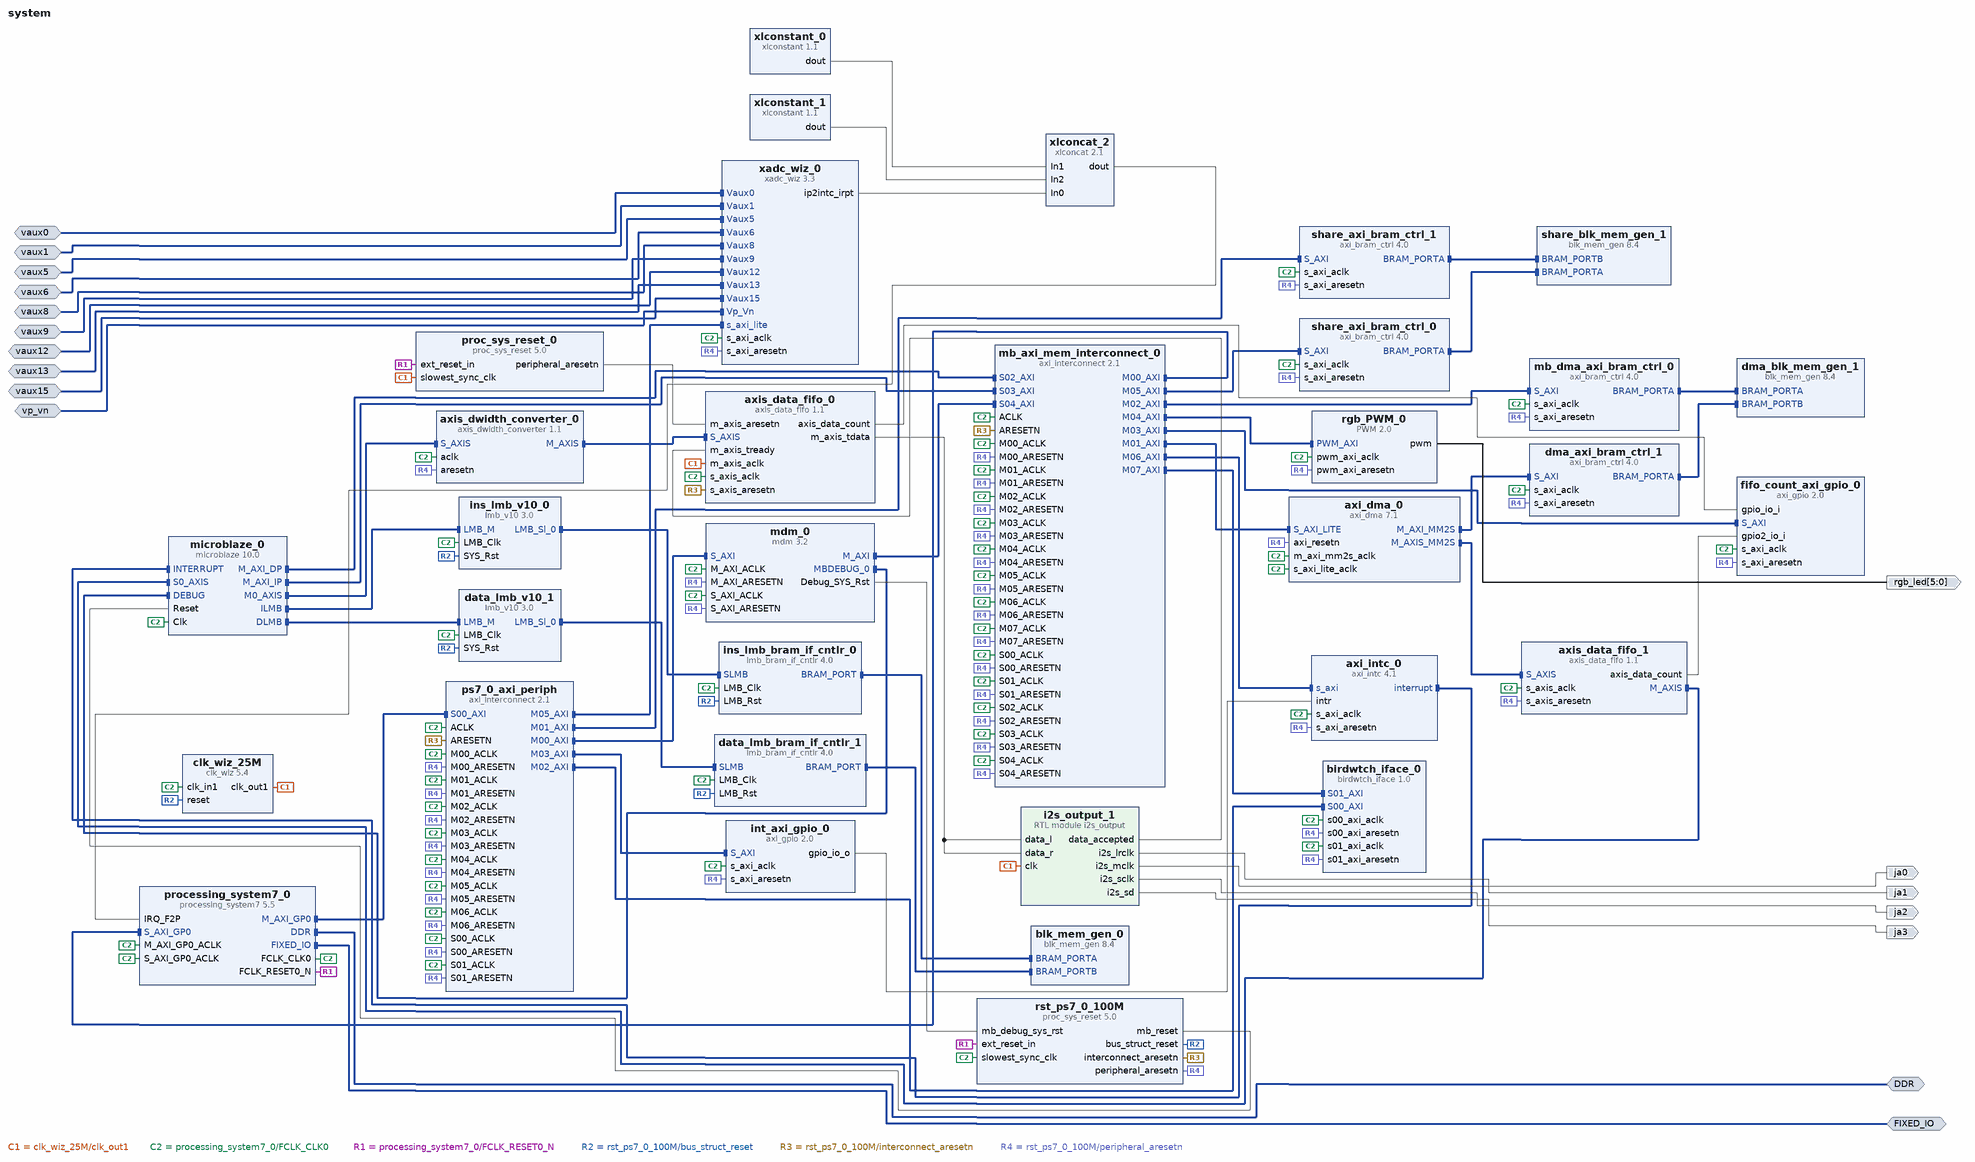
[diagram p0: block diagram of the top level]
# Vivado block design system, xc7z007sclg400-1, Vivado 2017.4
create_bd_design system

create_bd_intf_port -mode Master -vlnv xilinx.com:interface:ddrx_rtl:1.0 DDR
create_bd_intf_port -mode Master -vlnv xilinx.com:display_processing_system7:fixedio_rtl:1.0 FIXED_IO
create_bd_intf_port -mode Slave -vlnv xilinx.com:interface:diff_analog_io_rtl:1.0 vaux0
create_bd_intf_port -mode Slave -vlnv xilinx.com:interface:diff_analog_io_rtl:1.0 vaux1
create_bd_intf_port -mode Slave -vlnv xilinx.com:interface:diff_analog_io_rtl:1.0 vaux5
create_bd_intf_port -mode Slave -vlnv xilinx.com:interface:diff_analog_io_rtl:1.0 vaux6
create_bd_intf_port -mode Slave -vlnv xilinx.com:interface:diff_analog_io_rtl:1.0 vaux8
create_bd_intf_port -mode Slave -vlnv xilinx.com:interface:diff_analog_io_rtl:1.0 vaux9
create_bd_intf_port -mode Slave -vlnv xilinx.com:interface:diff_analog_io_rtl:1.0 vaux12
create_bd_intf_port -mode Slave -vlnv xilinx.com:interface:diff_analog_io_rtl:1.0 vaux13
create_bd_intf_port -mode Slave -vlnv xilinx.com:interface:diff_analog_io_rtl:1.0 vaux15
create_bd_intf_port -mode Slave -vlnv xilinx.com:interface:diff_analog_io_rtl:1.0 vp_vn
create_bd_port -dir O ja0
create_bd_port -dir O ja1
create_bd_port -dir O ja2
create_bd_port -dir O ja3
create_bd_port -dir O -from 5 -to 0 rgb_led

create_bd_cell -type ip -vlnv xilinx.com:ip:axi_dma:7.1 axi_dma_0
set_property -dict [list \
  CONFIG.c_include_sg 0 \
  CONFIG.c_include_mm2s 1 \
  CONFIG.c_m_axi_mm2s_data_width 32 \
  CONFIG.c_m_axis_mm2s_tdata_width 32 \
  CONFIG.c_mm2s_burst_size 16 \
  CONFIG.c_include_s2mm 0 \
] [get_bd_cells axi_dma_0]
create_bd_cell -type ip -vlnv xilinx.com:ip:axi_intc:4.1 axi_intc_0
set_property -dict {CONFIG.C_IRQ_IS_LEVEL 0} [get_bd_cells axi_intc_0]
create_bd_cell -type ip -vlnv xilinx.com:ip:axis_data_fifo:1.1 axis_data_fifo_0
set_property -dict [list \
  CONFIG.TDATA_NUM_BYTES 2 \
  CONFIG.FIFO_DEPTH 2048 \
  CONFIG.IS_ACLK_ASYNC 1 \
  CONFIG.ACLKEN_CONV_MODE 0 \
] [get_bd_cells axis_data_fifo_0]
create_bd_cell -type ip -vlnv xilinx.com:ip:axis_data_fifo:1.1 axis_data_fifo_1
set_property -dict {CONFIG.FIFO_DEPTH 2048} [get_bd_cells axis_data_fifo_1]
create_bd_cell -type ip -vlnv xilinx.com:ip:axis_dwidth_converter:1.1 axis_dwidth_converter_0
create_bd_cell -type ip -vlnv user.org:user:birdwtch_iface:1.0 birdwtch_iface_0
create_bd_cell -type ip -vlnv xilinx.com:ip:blk_mem_gen:8.4 blk_mem_gen_0
set_property -dict [list \
  CONFIG.Memory_Type True_Dual_Port_RAM \
  CONFIG.Enable_B Use_ENB_Pin \
  CONFIG.Use_RSTB_Pin true \
  CONFIG.Port_B_Clock 100 \
  CONFIG.Port_B_Write_Rate 50 \
  CONFIG.Port_B_Enable_Rate 100 \
] [get_bd_cells blk_mem_gen_0]
create_bd_cell -type ip -vlnv xilinx.com:ip:clk_wiz:5.4 clk_wiz_25M
set_property -dict [list \
  CONFIG.CLKOUT2_USED false \
  CONFIG.CLKOUT3_USED false \
  CONFIG.NUM_OUT_CLKS 1 \
  CONFIG.CLKOUT1_REQUESTED_OUT_FREQ 24.576 \
  CONFIG.CLKOUT2_REQUESTED_OUT_FREQ 100.000 \
  CONFIG.CLKOUT3_REQUESTED_OUT_FREQ 100.000 \
  CONFIG.CLKOUT3_REQUESTED_PHASE 0.000 \
  CONFIG.MMCM_DIVCLK_DIVIDE 5 \
  CONFIG.MMCM_CLKFBOUT_MULT_F 34.250 \
  CONFIG.MMCM_CLKOUT0_DIVIDE_F 27.875 \
  CONFIG.MMCM_CLKOUT1_DIVIDE 1 \
  CONFIG.MMCM_CLKOUT2_DIVIDE 1 \
  CONFIG.MMCM_CLKOUT2_PHASE 0.000 \
  CONFIG.CLKOUT1_JITTER 448.322 \
  CONFIG.CLKOUT1_PHASE_ERROR 335.207 \
  CONFIG.CLKOUT2_JITTER 783.134 \
  CONFIG.CLKOUT2_PHASE_ERROR 565.323 \
  CONFIG.CLKOUT3_JITTER 783.134 \
  CONFIG.CLKOUT3_PHASE_ERROR 565.323 \
] [get_bd_cells clk_wiz_25M]
create_bd_cell -type ip -vlnv xilinx.com:ip:lmb_bram_if_cntlr:4.0 data_lmb_bram_if_cntlr_1
create_bd_cell -type ip -vlnv xilinx.com:ip:lmb_v10:3.0 data_lmb_v10_1
create_bd_cell -type ip -vlnv xilinx.com:ip:axi_bram_ctrl:4.0 dma_axi_bram_ctrl_1
set_property -dict {CONFIG.DATA_WIDTH 32 CONFIG.SINGLE_PORT_BRAM 1} [get_bd_cells dma_axi_bram_ctrl_1]
create_bd_cell -type ip -vlnv xilinx.com:ip:blk_mem_gen:8.4 dma_blk_mem_gen_1
set_property -dict [list \
  CONFIG.Memory_Type True_Dual_Port_RAM \
  CONFIG.Enable_B Use_ENB_Pin \
  CONFIG.Use_RSTB_Pin true \
  CONFIG.Port_B_Clock 100 \
  CONFIG.Port_B_Write_Rate 50 \
  CONFIG.Port_B_Enable_Rate 100 \
] [get_bd_cells dma_blk_mem_gen_1]
create_bd_cell -type ip -vlnv xilinx.com:ip:axi_gpio:2.0 fifo_count_axi_gpio_0
set_property -dict [list \
  CONFIG.C_GPIO_WIDTH 32 \
  CONFIG.C_GPIO2_WIDTH 32 \
  CONFIG.C_IS_DUAL 1 \
  CONFIG.C_ALL_INPUTS 1 \
  CONFIG.C_ALL_INPUTS_2 1 \
] [get_bd_cells fifo_count_axi_gpio_0]
create_bd_cell -type module -reference i2s_output i2s_output_1
create_bd_cell -type ip -vlnv xilinx.com:ip:lmb_bram_if_cntlr:4.0 ins_lmb_bram_if_cntlr_0
create_bd_cell -type ip -vlnv xilinx.com:ip:lmb_v10:3.0 ins_lmb_v10_0
create_bd_cell -type ip -vlnv xilinx.com:ip:axi_gpio:2.0 int_axi_gpio_0
set_property -dict {CONFIG.C_GPIO_WIDTH 1 CONFIG.C_INTERRUPT_PRESENT 0 CONFIG.C_ALL_OUTPUTS 1} [get_bd_cells int_axi_gpio_0]
create_bd_cell -type ip -vlnv xilinx.com:ip:axi_interconnect:2.1 mb_axi_mem_interconnect_0
set_property -dict {CONFIG.NUM_SI 5 CONFIG.NUM_MI 8} [get_bd_cells mb_axi_mem_interconnect_0]
create_bd_cell -type ip -vlnv xilinx.com:ip:axi_bram_ctrl:4.0 mb_dma_axi_bram_ctrl_0
set_property -dict {CONFIG.SINGLE_PORT_BRAM 1} [get_bd_cells mb_dma_axi_bram_ctrl_0]
create_bd_cell -type ip -vlnv xilinx.com:ip:mdm:3.2 mdm_0
set_property -dict [list \
  CONFIG.C_S_AXI_ADDR_WIDTH 5 \
  CONFIG.C_USE_UART 1 \
  CONFIG.C_DBG_REG_ACCESS 1 \
  CONFIG.C_DBG_MEM_ACCESS 1 \
  CONFIG.C_USE_CROSS_TRIGGER 0 \
] [get_bd_cells mdm_0]
create_bd_cell -type ip -vlnv xilinx.com:ip:microblaze:10.0 microblaze_0
set_property -dict [list \
  CONFIG.C_ADDR_SIZE 32 \
  CONFIG.C_BASE_VECTORS 0x00000000 \
  CONFIG.C_D_AXI 1 \
  CONFIG.C_I_AXI 1 \
  CONFIG.C_USE_MSR_INSTR 0 \
  CONFIG.C_USE_PCMP_INSTR 0 \
  CONFIG.C_USE_BARREL 1 \
  CONFIG.C_USE_DIV 1 \
  CONFIG.C_USE_HW_MUL 1 \
  CONFIG.C_USE_FPU 0 \
  CONFIG.C_DEBUG_ENABLED 2 \
  CONFIG.C_NUMBER_OF_PC_BRK 2 \
  CONFIG.C_NUMBER_OF_RD_ADDR_BRK 0 \
  CONFIG.C_NUMBER_OF_WR_ADDR_BRK 0 \
  CONFIG.C_DEBUG_EVENT_COUNTERS 0 \
  CONFIG.C_DEBUG_LATENCY_COUNTERS 0 \
  CONFIG.C_FSL_LINKS 1 \
  CONFIG.C_ADDR_TAG_BITS 0 \
  CONFIG.C_DCACHE_ADDR_TAG 0 \
] [get_bd_cells microblaze_0]
create_bd_cell -type ip -vlnv xilinx.com:ip:proc_sys_reset:5.0 proc_sys_reset_0
create_bd_cell -type ip -vlnv xilinx.com:ip:processing_system7:5.5 processing_system7_0
set_property -dict [list \
  CONFIG.PCW_UIPARAM_DDR_FREQ_MHZ 525 \
  CONFIG.PCW_CRYSTAL_PERIPHERAL_FREQMHZ 50 \
  CONFIG.PCW_APU_PERIPHERAL_FREQMHZ 650 \
  CONFIG.PCW_SDIO_PERIPHERAL_FREQMHZ 50 \
  CONFIG.PCW_UART_PERIPHERAL_FREQMHZ 100 \
  CONFIG.PCW_I2C_PERIPHERAL_FREQMHZ 108.333336 \
  CONFIG.PCW_FPGA0_PERIPHERAL_FREQMHZ 100 \
  CONFIG.PCW_FPGA1_PERIPHERAL_FREQMHZ 200 \
  CONFIG.PCW_FPGA2_PERIPHERAL_FREQMHZ 120 \
  CONFIG.PCW_USE_S_AXI_GP0 1 \
  CONFIG.PCW_USE_FABRIC_INTERRUPT 1 \
  CONFIG.PCW_UART0_BAUD_RATE 921600 \
  CONFIG.PCW_IRQ_F2P_INTR 1 \
  CONFIG.PCW_GP0_EN_MODIFIABLE_TXN 0 \
  CONFIG.PCW_GP1_EN_MODIFIABLE_TXN 0 \
  CONFIG.PCW_PERIPHERAL_BOARD_PRESET part0 \
  CONFIG.PCW_PRESET_BANK1_VOLTAGE {LVCMOS 1.8V} \
  CONFIG.PCW_UIPARAM_DDR_BUS_WIDTH {16 Bit} \
  CONFIG.PCW_UIPARAM_DDR_PARTNO {MT41K256M16 RE-125} \
  CONFIG.PCW_QSPI_PERIPHERAL_ENABLE 0 \
  CONFIG.PCW_ENET0_PERIPHERAL_ENABLE 1 \
  CONFIG.PCW_ENET0_ENET0_IO {MIO 16 .. 27} \
  CONFIG.PCW_ENET0_GRP_MDIO_ENABLE 1 \
  CONFIG.PCW_ENET0_GRP_MDIO_IO {MIO 52 .. 53} \
  CONFIG.PCW_ENET_RESET_ENABLE 1 \
  CONFIG.PCW_ENET_RESET_SELECT {Share reset pin} \
  CONFIG.PCW_ENET0_RESET_ENABLE 1 \
  CONFIG.PCW_ENET0_RESET_IO {MIO 9} \
  CONFIG.PCW_SD0_PERIPHERAL_ENABLE 1 \
  CONFIG.PCW_SD0_SD0_IO {MIO 40 .. 45} \
  CONFIG.PCW_SD0_GRP_CD_ENABLE 1 \
  CONFIG.PCW_SD0_GRP_CD_IO {MIO 47} \
  CONFIG.PCW_SD0_GRP_WP_ENABLE 0 \
  CONFIG.PCW_UART0_PERIPHERAL_ENABLE 1 \
  CONFIG.PCW_UART0_UART0_IO {MIO 14 .. 15} \
  CONFIG.PCW_UART1_PERIPHERAL_ENABLE 0 \
  CONFIG.PCW_SPI0_PERIPHERAL_ENABLE 1 \
  CONFIG.PCW_SPI0_SPI0_IO EMIO \
  CONFIG.PCW_USB0_PERIPHERAL_ENABLE 1 \
  CONFIG.PCW_USB0_USB0_IO {MIO 28 .. 39} \
  CONFIG.PCW_USB_RESET_ENABLE 1 \
  CONFIG.PCW_USB_RESET_SELECT {Share reset pin} \
  CONFIG.PCW_USB0_RESET_ENABLE 1 \
  CONFIG.PCW_USB0_RESET_IO {MIO 46} \
  CONFIG.PCW_I2C0_PERIPHERAL_ENABLE 1 \
  CONFIG.PCW_I2C0_I2C0_IO EMIO \
  CONFIG.PCW_I2C_RESET_ENABLE 1 \
  CONFIG.PCW_I2C_RESET_SELECT {Share reset pin} \
  CONFIG.PCW_GPIO_MIO_GPIO_ENABLE 1 \
  CONFIG.PCW_GPIO_MIO_GPIO_IO MIO \
] [get_bd_cells processing_system7_0]
# 507 more settings of processing_system7_0 are not shown: defaults, MIO pin electricals, DDR timing, and values the tool derives
create_bd_cell -type ip -vlnv xilinx.com:ip:axi_interconnect:2.1 ps7_0_axi_periph
set_property -dict {CONFIG.NUM_SI 2 CONFIG.NUM_MI 7} [get_bd_cells ps7_0_axi_periph]
create_bd_cell -type ip -vlnv digilentinc.com:IP:PWM:2.0 rgb_PWM_0
set_property -dict {CONFIG.NUM_PWM 6} [get_bd_cells rgb_PWM_0]
create_bd_cell -type ip -vlnv xilinx.com:ip:proc_sys_reset:5.0 rst_ps7_0_100M
create_bd_cell -type ip -vlnv xilinx.com:ip:axi_bram_ctrl:4.0 share_axi_bram_ctrl_0
set_property -dict {CONFIG.SINGLE_PORT_BRAM 1} [get_bd_cells share_axi_bram_ctrl_0]
create_bd_cell -type ip -vlnv xilinx.com:ip:axi_bram_ctrl:4.0 share_axi_bram_ctrl_1
set_property -dict {CONFIG.SINGLE_PORT_BRAM 1} [get_bd_cells share_axi_bram_ctrl_1]
create_bd_cell -type ip -vlnv xilinx.com:ip:blk_mem_gen:8.4 share_blk_mem_gen_1
set_property -dict [list \
  CONFIG.Memory_Type True_Dual_Port_RAM \
  CONFIG.Enable_B Use_ENB_Pin \
  CONFIG.Use_RSTB_Pin true \
  CONFIG.Port_B_Clock 100 \
  CONFIG.Port_B_Write_Rate 50 \
  CONFIG.Port_B_Enable_Rate 100 \
] [get_bd_cells share_blk_mem_gen_1]
create_bd_cell -type ip -vlnv xilinx.com:ip:xadc_wiz:3.3 xadc_wiz_0
set_property -dict [list \
  CONFIG.XADC_STARUP_SELECTION channel_sequencer \
  CONFIG.SEQUENCER_MODE Continuous \
  CONFIG.SINGLE_CHANNEL_SELECTION TEMPERATURE \
  CONFIG.EXTERNAL_MUX_CHANNEL VP_VN \
  CONFIG.CHANNEL_ENABLE_CALIBRATION true \
  CONFIG.CHANNEL_ENABLE_TEMPERATURE true \
  CONFIG.CHANNEL_ENABLE_VCCINT true \
  CONFIG.CHANNEL_ENABLE_VCCAUX true \
  CONFIG.CHANNEL_ENABLE_VP_VN true \
  CONFIG.CHANNEL_ENABLE_VREFP true \
  CONFIG.CHANNEL_ENABLE_VREFN true \
  CONFIG.CHANNEL_ENABLE_VBRAM true \
  CONFIG.CHANNEL_ENABLE_VCCPINT true \
  CONFIG.CHANNEL_ENABLE_VCCPAUX true \
  CONFIG.CHANNEL_ENABLE_VCCDDRO true \
  CONFIG.CHANNEL_ENABLE_VAUXP0_VAUXN0 true \
  CONFIG.CHANNEL_ENABLE_VAUXP1_VAUXN1 true \
  CONFIG.CHANNEL_ENABLE_VAUXP5_VAUXN5 true \
  CONFIG.CHANNEL_ENABLE_VAUXP6_VAUXN6 true \
  CONFIG.CHANNEL_ENABLE_VAUXP8_VAUXN8 true \
  CONFIG.CHANNEL_ENABLE_VAUXP9_VAUXN9 true \
  CONFIG.CHANNEL_ENABLE_VAUXP12_VAUXN12 true \
  CONFIG.CHANNEL_ENABLE_VAUXP13_VAUXN13 true \
  CONFIG.CHANNEL_ENABLE_VAUXP15_VAUXN15 true \
] [get_bd_cells xadc_wiz_0]
create_bd_cell -type ip -vlnv xilinx.com:ip:xlconcat:2.1 xlconcat_2
set_property -dict {CONFIG.NUM_PORTS 3} [get_bd_cells xlconcat_2]
create_bd_cell -type ip -vlnv xilinx.com:ip:xlconstant:1.1 xlconstant_0
set_property -dict {CONFIG.CONST_VAL 0} [get_bd_cells xlconstant_0]
create_bd_cell -type ip -vlnv xilinx.com:ip:xlconstant:1.1 xlconstant_1
set_property -dict {CONFIG.CONST_VAL 0} [get_bd_cells xlconstant_1]

# ---- connections ----

connect_bd_intf_net [get_bd_intf_pins ins_lmb_bram_if_cntlr_0/SLMB] [get_bd_intf_pins ins_lmb_v10_0/LMB_Sl_0]
connect_bd_intf_net [get_bd_intf_pins data_lmb_bram_if_cntlr_1/SLMB] [get_bd_intf_pins data_lmb_v10_1/LMB_Sl_0]
connect_bd_intf_net -intf_net axi_bram_ctrl_0_BRAM_PORTA1 [get_bd_intf_pins share_axi_bram_ctrl_0/BRAM_PORTA] [get_bd_intf_pins share_blk_mem_gen_1/BRAM_PORTA]
connect_bd_intf_net -intf_net axi_bram_ctrl_1_BRAM_PORTA1 [get_bd_intf_pins share_axi_bram_ctrl_1/BRAM_PORTA] [get_bd_intf_pins share_blk_mem_gen_1/BRAM_PORTB]
connect_bd_intf_net [get_bd_intf_pins axi_dma_0/M_AXIS_MM2S] [get_bd_intf_pins axis_data_fifo_1/S_AXIS]
connect_bd_intf_net [get_bd_intf_pins axi_dma_0/M_AXI_MM2S] [get_bd_intf_pins dma_axi_bram_ctrl_1/S_AXI]
connect_bd_intf_net [get_bd_intf_pins axi_intc_0/interrupt] [get_bd_intf_pins microblaze_0/INTERRUPT]
connect_bd_intf_net [get_bd_intf_pins axis_data_fifo_1/M_AXIS] [get_bd_intf_pins microblaze_0/S0_AXIS]
connect_bd_intf_net [get_bd_intf_pins axis_data_fifo_0/S_AXIS] [get_bd_intf_pins axis_dwidth_converter_0/M_AXIS]
connect_bd_intf_net [get_bd_intf_pins blk_mem_gen_0/BRAM_PORTB] [get_bd_intf_pins data_lmb_bram_if_cntlr_1/BRAM_PORT]
connect_bd_intf_net [get_bd_intf_pins dma_axi_bram_ctrl_1/BRAM_PORTA] [get_bd_intf_pins dma_blk_mem_gen_1/BRAM_PORTB]
connect_bd_intf_net [get_bd_intf_pins blk_mem_gen_0/BRAM_PORTA] [get_bd_intf_pins ins_lmb_bram_if_cntlr_0/BRAM_PORT]
connect_bd_intf_net [get_bd_intf_pins mb_axi_mem_interconnect_0/M00_AXI] [get_bd_intf_pins processing_system7_0/S_AXI_GP0]
connect_bd_intf_net [get_bd_intf_pins axi_dma_0/S_AXI_LITE] [get_bd_intf_pins mb_axi_mem_interconnect_0/M01_AXI]
connect_bd_intf_net [get_bd_intf_pins mb_axi_mem_interconnect_0/M02_AXI] [get_bd_intf_pins mb_dma_axi_bram_ctrl_0/S_AXI]
connect_bd_intf_net [get_bd_intf_pins fifo_count_axi_gpio_0/S_AXI] [get_bd_intf_pins mb_axi_mem_interconnect_0/M03_AXI]
connect_bd_intf_net [get_bd_intf_pins mb_axi_mem_interconnect_0/M04_AXI] [get_bd_intf_pins rgb_PWM_0/PWM_AXI]
connect_bd_intf_net [get_bd_intf_pins mb_axi_mem_interconnect_0/M05_AXI] [get_bd_intf_pins share_axi_bram_ctrl_0/S_AXI]
connect_bd_intf_net [get_bd_intf_pins axi_intc_0/s_axi] [get_bd_intf_pins mb_axi_mem_interconnect_0/M06_AXI]
connect_bd_intf_net [get_bd_intf_pins birdwtch_iface_0/S01_AXI] [get_bd_intf_pins mb_axi_mem_interconnect_0/M07_AXI]
connect_bd_intf_net [get_bd_intf_pins dma_blk_mem_gen_1/BRAM_PORTA] [get_bd_intf_pins mb_dma_axi_bram_ctrl_0/BRAM_PORTA]
connect_bd_intf_net [get_bd_intf_pins mdm_0/MBDEBUG_0] [get_bd_intf_pins microblaze_0/DEBUG]
connect_bd_intf_net [get_bd_intf_pins mb_axi_mem_interconnect_0/S04_AXI] [get_bd_intf_pins mdm_0/M_AXI]
connect_bd_intf_net [get_bd_intf_pins data_lmb_v10_1/LMB_M] [get_bd_intf_pins microblaze_0/DLMB]
connect_bd_intf_net [get_bd_intf_pins ins_lmb_v10_0/LMB_M] [get_bd_intf_pins microblaze_0/ILMB]
connect_bd_intf_net [get_bd_intf_pins axis_dwidth_converter_0/S_AXIS] [get_bd_intf_pins microblaze_0/M0_AXIS]
connect_bd_intf_net [get_bd_intf_pins mb_axi_mem_interconnect_0/S02_AXI] [get_bd_intf_pins microblaze_0/M_AXI_DP]
connect_bd_intf_net [get_bd_intf_pins mb_axi_mem_interconnect_0/S03_AXI] [get_bd_intf_pins microblaze_0/M_AXI_IP]
connect_bd_intf_net [get_bd_intf_pins processing_system7_0/M_AXI_GP0] [get_bd_intf_pins ps7_0_axi_periph/S00_AXI]
connect_bd_intf_net [get_bd_intf_pins mdm_0/S_AXI] [get_bd_intf_pins ps7_0_axi_periph/M00_AXI]
connect_bd_intf_net [get_bd_intf_pins ps7_0_axi_periph/M01_AXI] [get_bd_intf_pins share_axi_bram_ctrl_1/S_AXI]
connect_bd_intf_net [get_bd_intf_pins birdwtch_iface_0/S00_AXI] [get_bd_intf_pins ps7_0_axi_periph/M02_AXI]
connect_bd_intf_net [get_bd_intf_pins int_axi_gpio_0/S_AXI] [get_bd_intf_pins ps7_0_axi_periph/M03_AXI]
connect_bd_intf_net [get_bd_intf_pins ps7_0_axi_periph/M05_AXI] [get_bd_intf_pins xadc_wiz_0/s_axi_lite]
connect_bd_intf_net [get_bd_intf_ports DDR] [get_bd_intf_pins processing_system7_0/DDR]
connect_bd_intf_net [get_bd_intf_ports FIXED_IO] [get_bd_intf_pins processing_system7_0/FIXED_IO]
connect_bd_intf_net -intf_net Vaux0_0_1 [get_bd_intf_ports vaux0] [get_bd_intf_pins xadc_wiz_0/Vaux0]
connect_bd_intf_net -intf_net Vaux1_0_1 [get_bd_intf_ports vaux1] [get_bd_intf_pins xadc_wiz_0/Vaux1]
connect_bd_intf_net -intf_net Vaux5_0_1 [get_bd_intf_ports vaux5] [get_bd_intf_pins xadc_wiz_0/Vaux5]
connect_bd_intf_net -intf_net Vaux6_0_1 [get_bd_intf_ports vaux6] [get_bd_intf_pins xadc_wiz_0/Vaux6]
connect_bd_intf_net -intf_net Vaux8_0_1 [get_bd_intf_ports vaux8] [get_bd_intf_pins xadc_wiz_0/Vaux8]
connect_bd_intf_net -intf_net Vaux9_0_1 [get_bd_intf_ports vaux9] [get_bd_intf_pins xadc_wiz_0/Vaux9]
connect_bd_intf_net -intf_net Vaux12_0_1 [get_bd_intf_ports vaux12] [get_bd_intf_pins xadc_wiz_0/Vaux12]
connect_bd_intf_net -intf_net Vaux13_0_1 [get_bd_intf_ports vaux13] [get_bd_intf_pins xadc_wiz_0/Vaux13]
connect_bd_intf_net -intf_net Vaux15_0_1 [get_bd_intf_ports vaux15] [get_bd_intf_pins xadc_wiz_0/Vaux15]
connect_bd_intf_net -intf_net Vp_Vn_0_1 [get_bd_intf_ports vp_vn] [get_bd_intf_pins xadc_wiz_0/Vp_Vn]
connect_bd_net -net axi_gpio_0_gpio_io_o [get_bd_pins int_axi_gpio_0/gpio_io_o] [get_bd_pins axi_intc_0/intr]
connect_bd_net [get_bd_pins axis_data_fifo_0/axis_data_count] [get_bd_pins fifo_count_axi_gpio_0/gpio_io_i]
connect_bd_net [get_bd_pins axis_data_fifo_1/axis_data_count] [get_bd_pins fifo_count_axi_gpio_0/gpio2_io_i]
connect_bd_net -net axis_register_slice_0_m_axis_tdata [get_bd_pins axis_data_fifo_0/m_axis_tdata] \
  [get_bd_pins i2s_output_1/data_l] [get_bd_pins i2s_output_1/data_r]
connect_bd_net -net clk_wiz_0_clk_out1 [get_bd_pins clk_wiz_25M/clk_out1] \
  [get_bd_pins axis_data_fifo_0/m_axis_aclk] [get_bd_pins i2s_output_1/clk] [get_bd_pins proc_sys_reset_0/slowest_sync_clk]
connect_bd_net [get_bd_pins i2s_output_1/data_accepted] [get_bd_pins axis_data_fifo_0/m_axis_tready]
connect_bd_net [get_bd_pins i2s_output_1/i2s_lrclk] [get_bd_ports ja1]
connect_bd_net [get_bd_pins i2s_output_1/i2s_mclk] [get_bd_ports ja0]
connect_bd_net [get_bd_pins i2s_output_1/i2s_sclk] [get_bd_ports ja2]
connect_bd_net [get_bd_pins i2s_output_1/i2s_sd] [get_bd_ports ja3]
connect_bd_net [get_bd_pins mdm_0/Debug_SYS_Rst] [get_bd_pins rst_ps7_0_100M/mb_debug_sys_rst]
connect_bd_net [get_bd_pins proc_sys_reset_0/peripheral_aresetn] [get_bd_pins axis_data_fifo_0/m_axis_aresetn]
connect_bd_net [get_bd_pins processing_system7_0/FCLK_CLK0] \
  [get_bd_pins axi_dma_0/m_axi_mm2s_aclk] [get_bd_pins axi_dma_0/s_axi_lite_aclk] [get_bd_pins axi_intc_0/s_axi_aclk] \
  [get_bd_pins axis_data_fifo_0/s_axis_aclk] [get_bd_pins axis_data_fifo_1/s_axis_aclk] \
  [get_bd_pins axis_dwidth_converter_0/aclk] [get_bd_pins birdwtch_iface_0/s00_axi_aclk] \
  [get_bd_pins birdwtch_iface_0/s01_axi_aclk] [get_bd_pins clk_wiz_25M/clk_in1] \
  [get_bd_pins data_lmb_bram_if_cntlr_1/LMB_Clk] [get_bd_pins data_lmb_v10_1/LMB_Clk] \
  [get_bd_pins dma_axi_bram_ctrl_1/s_axi_aclk] [get_bd_pins fifo_count_axi_gpio_0/s_axi_aclk] \
  [get_bd_pins ins_lmb_bram_if_cntlr_0/LMB_Clk] [get_bd_pins ins_lmb_v10_0/LMB_Clk] [get_bd_pins int_axi_gpio_0/s_axi_aclk] \
  [get_bd_pins mb_axi_mem_interconnect_0/ACLK] [get_bd_pins mb_axi_mem_interconnect_0/M00_ACLK] \
  [get_bd_pins mb_axi_mem_interconnect_0/M01_ACLK] [get_bd_pins mb_axi_mem_interconnect_0/M02_ACLK] \
  [get_bd_pins mb_axi_mem_interconnect_0/M03_ACLK] [get_bd_pins mb_axi_mem_interconnect_0/M04_ACLK] \
  [get_bd_pins mb_axi_mem_interconnect_0/M05_ACLK] [get_bd_pins mb_axi_mem_interconnect_0/M06_ACLK] \
  [get_bd_pins mb_axi_mem_interconnect_0/M07_ACLK] [get_bd_pins mb_axi_mem_interconnect_0/S00_ACLK] \
  [get_bd_pins mb_axi_mem_interconnect_0/S01_ACLK] [get_bd_pins mb_axi_mem_interconnect_0/S02_ACLK] \
  [get_bd_pins mb_axi_mem_interconnect_0/S03_ACLK] [get_bd_pins mb_axi_mem_interconnect_0/S04_ACLK] \
  [get_bd_pins mb_dma_axi_bram_ctrl_0/s_axi_aclk] [get_bd_pins mdm_0/M_AXI_ACLK] [get_bd_pins mdm_0/S_AXI_ACLK] \
  [get_bd_pins microblaze_0/Clk] [get_bd_pins processing_system7_0/M_AXI_GP0_ACLK] \
  [get_bd_pins processing_system7_0/S_AXI_GP0_ACLK] [get_bd_pins ps7_0_axi_periph/ACLK] \
  [get_bd_pins ps7_0_axi_periph/M00_ACLK] [get_bd_pins ps7_0_axi_periph/M01_ACLK] [get_bd_pins ps7_0_axi_periph/M02_ACLK] \
  [get_bd_pins ps7_0_axi_periph/M03_ACLK] [get_bd_pins ps7_0_axi_periph/M04_ACLK] [get_bd_pins ps7_0_axi_periph/M05_ACLK] \
  [get_bd_pins ps7_0_axi_periph/M06_ACLK] [get_bd_pins ps7_0_axi_periph/S00_ACLK] [get_bd_pins ps7_0_axi_periph/S01_ACLK] \
  [get_bd_pins rgb_PWM_0/pwm_axi_aclk] [get_bd_pins rst_ps7_0_100M/slowest_sync_clk] \
  [get_bd_pins share_axi_bram_ctrl_0/s_axi_aclk] [get_bd_pins share_axi_bram_ctrl_1/s_axi_aclk] \
  [get_bd_pins xadc_wiz_0/s_axi_aclk]
connect_bd_net [get_bd_pins processing_system7_0/FCLK_RESET0_N] [get_bd_pins proc_sys_reset_0/ext_reset_in] [get_bd_pins rst_ps7_0_100M/ext_reset_in]
connect_bd_net [get_bd_pins rgb_PWM_0/pwm] [get_bd_ports rgb_led]
connect_bd_net [get_bd_pins rst_ps7_0_100M/bus_struct_reset] \
  [get_bd_pins clk_wiz_25M/reset] [get_bd_pins data_lmb_bram_if_cntlr_1/LMB_Rst] [get_bd_pins data_lmb_v10_1/SYS_Rst] \
  [get_bd_pins ins_lmb_bram_if_cntlr_0/LMB_Rst] [get_bd_pins ins_lmb_v10_0/SYS_Rst]
connect_bd_net [get_bd_pins rst_ps7_0_100M/interconnect_aresetn] \
  [get_bd_pins axis_data_fifo_0/s_axis_aresetn] [get_bd_pins mb_axi_mem_interconnect_0/ARESETN] \
  [get_bd_pins ps7_0_axi_periph/ARESETN]
connect_bd_net [get_bd_pins rst_ps7_0_100M/mb_reset] [get_bd_pins microblaze_0/Reset]
connect_bd_net [get_bd_pins rst_ps7_0_100M/peripheral_aresetn] \
  [get_bd_pins axi_dma_0/axi_resetn] [get_bd_pins axi_intc_0/s_axi_aresetn] [get_bd_pins axis_data_fifo_1/s_axis_aresetn] \
  [get_bd_pins axis_dwidth_converter_0/aresetn] [get_bd_pins birdwtch_iface_0/s00_axi_aresetn] \
  [get_bd_pins birdwtch_iface_0/s01_axi_aresetn] [get_bd_pins dma_axi_bram_ctrl_1/s_axi_aresetn] \
  [get_bd_pins fifo_count_axi_gpio_0/s_axi_aresetn] [get_bd_pins int_axi_gpio_0/s_axi_aresetn] \
  [get_bd_pins mb_axi_mem_interconnect_0/M00_ARESETN] [get_bd_pins mb_axi_mem_interconnect_0/M01_ARESETN] \
  [get_bd_pins mb_axi_mem_interconnect_0/M02_ARESETN] [get_bd_pins mb_axi_mem_interconnect_0/M03_ARESETN] \
  [get_bd_pins mb_axi_mem_interconnect_0/M04_ARESETN] [get_bd_pins mb_axi_mem_interconnect_0/M05_ARESETN] \
  [get_bd_pins mb_axi_mem_interconnect_0/M06_ARESETN] [get_bd_pins mb_axi_mem_interconnect_0/M07_ARESETN] \
  [get_bd_pins mb_axi_mem_interconnect_0/S00_ARESETN] [get_bd_pins mb_axi_mem_interconnect_0/S01_ARESETN] \
  [get_bd_pins mb_axi_mem_interconnect_0/S02_ARESETN] [get_bd_pins mb_axi_mem_interconnect_0/S03_ARESETN] \
  [get_bd_pins mb_axi_mem_interconnect_0/S04_ARESETN] [get_bd_pins mb_dma_axi_bram_ctrl_0/s_axi_aresetn] \
  [get_bd_pins mdm_0/M_AXI_ARESETN] [get_bd_pins mdm_0/S_AXI_ARESETN] [get_bd_pins ps7_0_axi_periph/M00_ARESETN] \
  [get_bd_pins ps7_0_axi_periph/M01_ARESETN] [get_bd_pins ps7_0_axi_periph/M02_ARESETN] \
  [get_bd_pins ps7_0_axi_periph/M03_ARESETN] [get_bd_pins ps7_0_axi_periph/M04_ARESETN] \
  [get_bd_pins ps7_0_axi_periph/M05_ARESETN] [get_bd_pins ps7_0_axi_periph/M06_ARESETN] \
  [get_bd_pins ps7_0_axi_periph/S00_ARESETN] [get_bd_pins ps7_0_axi_periph/S01_ARESETN] \
  [get_bd_pins rgb_PWM_0/pwm_axi_aresetn] [get_bd_pins share_axi_bram_ctrl_0/s_axi_aresetn] \
  [get_bd_pins share_axi_bram_ctrl_1/s_axi_aresetn] [get_bd_pins xadc_wiz_0/s_axi_aresetn]
connect_bd_net [get_bd_pins xadc_wiz_0/ip2intc_irpt] [get_bd_pins xlconcat_2/In0]
connect_bd_net [get_bd_pins xlconcat_2/dout] [get_bd_pins processing_system7_0/IRQ_F2P]
connect_bd_net [get_bd_pins xlconstant_0/dout] [get_bd_pins xlconcat_2/In1]
connect_bd_net [get_bd_pins xlconstant_1/dout] [get_bd_pins xlconcat_2/In2]

# ---- address map ----
assign_bd_address -offset 0x40008000 -range 32K -target_address_space [get_bd_addr_spaces axi_dma_0/Data_MM2S] [get_bd_addr_segs dma_axi_bram_ctrl_1/S_AXI/Mem0]
assign_bd_address -offset 0x04A10000 -range 64K -target_address_space [get_bd_addr_spaces mdm_0/Data] [get_bd_addr_segs rgb_PWM_0/PWM_AXI/PWM_AXI_reg]
assign_bd_address -offset 0x04B00000 -range 8K -target_address_space [get_bd_addr_spaces mdm_0/Data] [get_bd_addr_segs share_axi_bram_ctrl_0/S_AXI/Mem0]
assign_bd_address -offset 0x04B10000 -range 64K -target_address_space [get_bd_addr_spaces mdm_0/Data] [get_bd_addr_segs axi_dma_0/S_AXI_LITE/Reg]
assign_bd_address -offset 0x04B20000 -range 64K -target_address_space [get_bd_addr_spaces mdm_0/Data] [get_bd_addr_segs fifo_count_axi_gpio_0/S_AXI/Reg]
assign_bd_address -offset 0x04B30000 -range 64K -target_address_space [get_bd_addr_spaces mdm_0/Data] [get_bd_addr_segs axi_intc_0/S_AXI/Reg]
assign_bd_address -offset 0x80000000 -range 64K -target_address_space [get_bd_addr_spaces mdm_0/Data] [get_bd_addr_segs birdwtch_iface_0/S01_AXI_mem/S01_reg]
assign_bd_address -offset 0xC0000000 -range 32K -target_address_space [get_bd_addr_spaces mdm_0/Data] [get_bd_addr_segs mb_dma_axi_bram_ctrl_0/S_AXI/Mem0]
assign_bd_address -offset 0xE0000000 -range 4M -target_address_space [get_bd_addr_spaces mdm_0/Data] [get_bd_addr_segs processing_system7_0/S_AXI_GP0/GP0_IOP]
exclude_bd_addr_seg -offset 0x20000000 -range 512M -target_address_space [get_bd_addr_spaces mdm_0/Data] [get_bd_addr_segs processing_system7_0/S_AXI_GP0/GP0_DDR_LOWOCM]
exclude_bd_addr_seg -offset 0x40000000 -range 1G -target_address_space [get_bd_addr_spaces mdm_0/Data] [get_bd_addr_segs processing_system7_0/S_AXI_GP0/GP0_M_AXI_GP0]
exclude_bd_addr_seg -offset 0x43400000 -range 4K -target_address_space [get_bd_addr_spaces mdm_0/Data] [get_bd_addr_segs mdm_0/S_AXI/Reg]
assign_bd_address -offset 0x00000000 -range 128K -target_address_space [get_bd_addr_spaces microblaze_0/Data] [get_bd_addr_segs data_lmb_bram_if_cntlr_1/SLMB/Mem]
assign_bd_address -offset 0x04A10000 -range 64K -target_address_space [get_bd_addr_spaces microblaze_0/Data] [get_bd_addr_segs rgb_PWM_0/PWM_AXI/PWM_AXI_reg]
assign_bd_address -offset 0x04B00000 -range 8K -target_address_space [get_bd_addr_spaces microblaze_0/Data] [get_bd_addr_segs share_axi_bram_ctrl_0/S_AXI/Mem0]
assign_bd_address -offset 0x04B10000 -range 64K -target_address_space [get_bd_addr_spaces microblaze_0/Data] [get_bd_addr_segs axi_dma_0/S_AXI_LITE/Reg]
assign_bd_address -offset 0x04B20000 -range 64K -target_address_space [get_bd_addr_spaces microblaze_0/Data] [get_bd_addr_segs fifo_count_axi_gpio_0/S_AXI/Reg]
assign_bd_address -offset 0x04B30000 -range 64K -target_address_space [get_bd_addr_spaces microblaze_0/Data] [get_bd_addr_segs axi_intc_0/S_AXI/Reg]
assign_bd_address -offset 0x20000000 -range 512M -target_address_space [get_bd_addr_spaces microblaze_0/Data] [get_bd_addr_segs processing_system7_0/S_AXI_GP0/GP0_DDR_LOWOCM]
assign_bd_address -offset 0x80000000 -range 64K -target_address_space [get_bd_addr_spaces microblaze_0/Data] [get_bd_addr_segs birdwtch_iface_0/S01_AXI_mem/S01_reg]
assign_bd_address -offset 0xC0000000 -range 32K -target_address_space [get_bd_addr_spaces microblaze_0/Data] [get_bd_addr_segs mb_dma_axi_bram_ctrl_0/S_AXI/Mem0]
assign_bd_address -offset 0xE0000000 -range 4M -target_address_space [get_bd_addr_spaces microblaze_0/Data] [get_bd_addr_segs processing_system7_0/S_AXI_GP0/GP0_IOP]
exclude_bd_addr_seg -offset 0x40000000 -range 1G -target_address_space [get_bd_addr_spaces microblaze_0/Data] [get_bd_addr_segs processing_system7_0/S_AXI_GP0/GP0_M_AXI_GP0]
assign_bd_address -offset 0x00000000 -range 128K -target_address_space [get_bd_addr_spaces microblaze_0/Instruction] [get_bd_addr_segs ins_lmb_bram_if_cntlr_0/SLMB/Mem]
assign_bd_address -offset 0x04A10000 -range 64K -target_address_space [get_bd_addr_spaces microblaze_0/Instruction] [get_bd_addr_segs rgb_PWM_0/PWM_AXI/PWM_AXI_reg]
assign_bd_address -offset 0x04B00000 -range 8K -target_address_space [get_bd_addr_spaces microblaze_0/Instruction] [get_bd_addr_segs share_axi_bram_ctrl_0/S_AXI/Mem0]
assign_bd_address -offset 0x04B10000 -range 64K -target_address_space [get_bd_addr_spaces microblaze_0/Instruction] [get_bd_addr_segs axi_dma_0/S_AXI_LITE/Reg]
assign_bd_address -offset 0x04B20000 -range 64K -target_address_space [get_bd_addr_spaces microblaze_0/Instruction] [get_bd_addr_segs fifo_count_axi_gpio_0/S_AXI/Reg]
assign_bd_address -offset 0x04B30000 -range 64K -target_address_space [get_bd_addr_spaces microblaze_0/Instruction] [get_bd_addr_segs axi_intc_0/S_AXI/Reg]
assign_bd_address -offset 0x20000000 -range 512M -target_address_space [get_bd_addr_spaces microblaze_0/Instruction] [get_bd_addr_segs processing_system7_0/S_AXI_GP0/GP0_DDR_LOWOCM]
assign_bd_address -offset 0x80000000 -range 64K -target_address_space [get_bd_addr_spaces microblaze_0/Instruction] [get_bd_addr_segs birdwtch_iface_0/S01_AXI_mem/S01_reg]
assign_bd_address -offset 0xC0000000 -range 32K -target_address_space [get_bd_addr_spaces microblaze_0/Instruction] [get_bd_addr_segs mb_dma_axi_bram_ctrl_0/S_AXI/Mem0]
assign_bd_address -offset 0xE0000000 -range 4M -target_address_space [get_bd_addr_spaces microblaze_0/Instruction] [get_bd_addr_segs processing_system7_0/S_AXI_GP0/GP0_IOP]
exclude_bd_addr_seg -offset 0x40000000 -range 1G -target_address_space [get_bd_addr_spaces microblaze_0/Instruction] [get_bd_addr_segs processing_system7_0/S_AXI_GP0/GP0_M_AXI_GP0]
assign_bd_address -offset 0x40000000 -range 8K -target_address_space [get_bd_addr_spaces processing_system7_0/Data] [get_bd_addr_segs share_axi_bram_ctrl_1/S_AXI/Mem0]
assign_bd_address -offset 0x41200000 -range 64K -target_address_space [get_bd_addr_spaces processing_system7_0/Data] [get_bd_addr_segs int_axi_gpio_0/S_AXI/Reg]
assign_bd_address -offset 0x43400000 -range 4K -target_address_space [get_bd_addr_spaces processing_system7_0/Data] [get_bd_addr_segs mdm_0/S_AXI/Reg]
assign_bd_address -offset 0x43C00000 -range 64K -target_address_space [get_bd_addr_spaces processing_system7_0/Data] [get_bd_addr_segs birdwtch_iface_0/S00_AXI_mem/S00_reg]
assign_bd_address -offset 0x43C10000 -range 64K -target_address_space [get_bd_addr_spaces processing_system7_0/Data] [get_bd_addr_segs xadc_wiz_0/s_axi_lite/Reg]

validate_bd_design
save_bd_design
